# Altium schematic sheet MohamedAazir_WirelessEMG__version_1.0_PCB__Power.schdoc
size 280 x 206 mm
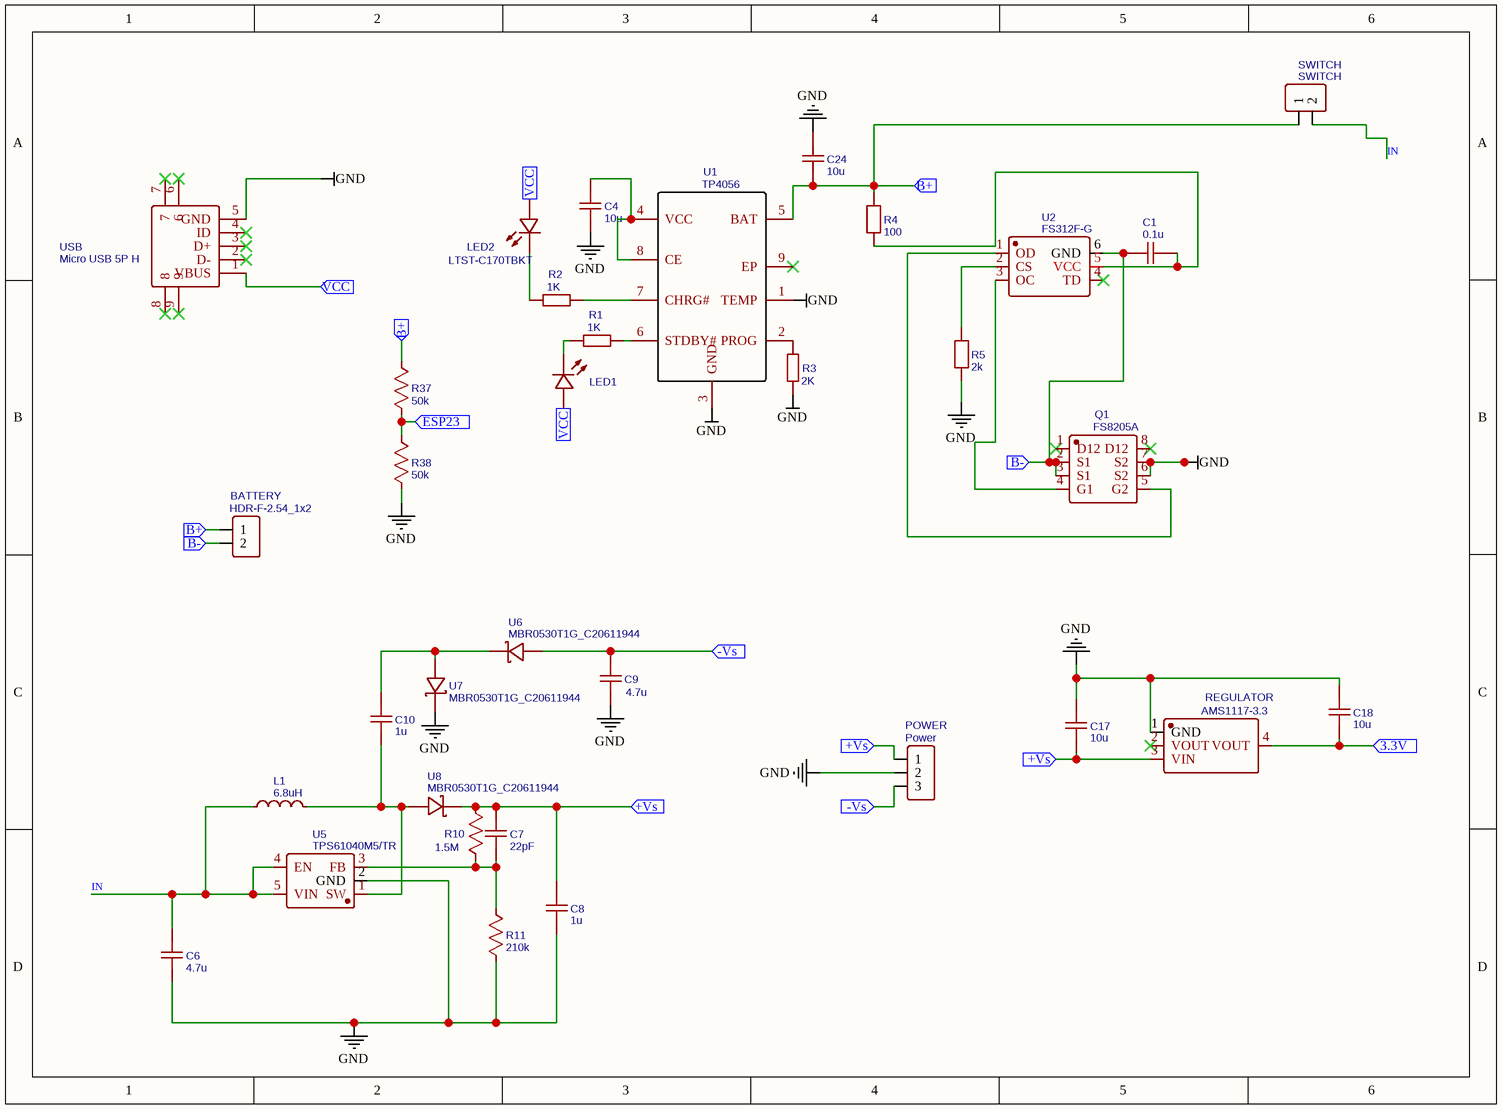
[diagram p0: MohamedAazir_WirelessEMG__version_1.0_PCB__Power.schdoc]

## Parts
BATTERY  HDR-F-2.54_1x2  [HDR-F-2.54_1X2]
C1  0.1u  [C0603]
C4  10u  [C0603]
C6  4.7u  [C0603]
C7  22pF  [C0603]
C8  1u  [C0603]
C9  4.7u  [C0603]
C10  1u  [C0603]
C17  10u  [C0603]
C18  10u  [C0603]
C24  10u  [C0603]
L1  6.8uH  [L0603]
LED1  0805G (Green)  [LED0805-RD_GREEN]  (value not drawn)
LED2  LTST-C170TBKT  [LED0805-RD_BLUE]
POWER  Power  [HDR-TH_3P-P2.54-V-F]
Q1  FS8205A  [TSSOP-8_L4.4-W3.0-P0.65-LS6.4-BL-2]
R1  1K  [R0603]
R2  1K  [R0603]
R3  2K  [R0603]
R4  100  [R0603]
R5  2k  [R0603]
R10  1.5M  [R0603]
R11  210k  [R0603]
R37  50k  [R0603]
R38  50k  [R0603]
REGULATOR  AMS1117-3.3  [SOT-223-3_L6.5-W3.4-P2.30-LS7.0-BR]
SWITCH  SWITCH  [HDR-F-2.54_1X2]
U1  TP4056  [ESOP-8_L4.9-W3.9-P1.27-LS6.0-BL-EP]
U2  FS312F-G  [SOT-23-6_L2.9-W1.6-P0.95-LS2.8-BR]
U5  TPS61040M5/TR  [SOT-23-5_L2.9-W1.6-P0.95-LS2.8-BL]
U6  MBR0530T1G_C20611944  [SOD-123_L2.8-W1.8-LS3.7-RD]
U7  MBR0530T1G_C20611944  [SOD-123_L2.8-W1.8-LS3.7-RD]
U8  MBR0530T1G_C20611944  [SOD-123_L2.8-W1.8-LS3.7-RD]
USB  Micro USB 5P H  [MICRO-USB_MICRO-USB-30]

## Ports
3.3V (in), +Vs (in), -Vs (in), B+ (in), B- (in), ESP23 (in), VCC (in)

## Nets
GND: C4.2 C6.1 C8.1 C9.1 C17.2 C18.2 C24.2 POWER.2 Q1.6(S2) Q1.7(S2) R3.1 R5.1 R11.1 R38.1 REGULATOR.1(GND) U1.1(TEMP) U1.3(GND) U5.2(GND) U7.1(K) USB.5(GND)
3.3V: C18.1 REGULATOR.4(VOUT) ; port 3.3V
+Vs: C7.2 C8.2 C17.1 POWER.1 R10.2 REGULATOR.3(VIN) U8.1(K) ; port +Vs
-Vs: C9.2 POWER.3 U6.2(A) ; port -Vs
B+: BATTERY.1 C24.1 R4.1 R37.2 SWITCH.1 U1.5(BAT) ; port B+
B-: BATTERY.2 C1.1 Q1.2(S1) Q1.3(S1) U2.6(GND) ; port B-
ESP23: R37.1 R38.2 ; port ESP23
IN: C6.2 L1.1 SWITCH.2 U5.4(EN) U5.5(VIN)
VCC: LED1.2(A) LED2.2(A) USB.1(VBUS) ; port VCC
NetC1_2: C1.2 R4.2 U2.5(VCC)
NetC4_1: C4.1 U1.4(VCC) U1.8(CE)
NetC7_1: C7.1 R10.1 R11.2 U5.3(FB)
NetC10_1: C10.1 L1.2 U5.1(SW) U8.2(A)
NetC10_2: C10.2 U6.1(K) U7.2(A)
NetLED1_1: LED1.1(K) R1.1
NetLED2_1: LED2.1(K) R2.1
NetQ1_4: Q1.4(G1) U2.3(OC)
NetQ1_5: Q1.5(G2) U2.1(OD)
NetR1_2: R1.2 U1.6(STDBY#)
NetR2_2: R2.2 U1.7(CHRG#)
NetR3_2: R3.2 U1.2(PROG)
NetR5_2: R5.2 U2.2(CS)

Not connected (* = marked no-connect by the designer): Q1 1(D12)* 8(D12)*; REGULATOR 2(VOUT)*; U1 9(EP)*; U2 4(TD)*; USB 2(D-)* 3(D+)* 4(ID)* 6* 7* 8* 9*

## Library data of the parts
BATTERY = HDR-F-2.54_1x2: Manufacturer: HC(虹成电子); Manufacturer Part: HC-PM254-8.5H-1x2PZ; Contributor: LCEDA_Lib; Supplier Part: C22373888; Supplier: LCSC; spicePre: H; spiceSymbolName: HDR-F-2.54_1x2
C1 = 0.1u: Manufacturer Part: RF18N0R1B500CT; Manufacturer: Walsin(华新科); nameAlias: Value(F); Contributor: LCEDA_Lib; Supplier Part: C304680; Supplier: LCSC; spicePre: C; spiceSymbolName: C_0603_US
C4 = 10u: Manufacturer Part: CA45A-P-10V-10uF-K; Manufacturer: CEC(振华新云); nameAlias: Value(F); Contributor: LCEDA_Lib; Supplier Part: C129234; Supplier: LCSC; spicePre: C; spiceSymbolName: C_0603_US
C6 C9 = 4.7u: Manufacturer Part: CA45B-A-25V-4.7UF-K; Manufacturer: CEC(振华新云); nameAlias: Value(F); Contributor: LCEDA_Lib; Supplier Part: C2976925; Supplier: LCSC; spicePre: C; spiceSymbolName: C_0603_US
C7 = 22pF: Manufacturer Part: 0805N220J500CT-C; Manufacturer: Walsin(华新科); nameAlias: Value(F); Contributor: LCEDA_Lib; Supplier Part: C2991347; Supplier: LCSC; spicePre: C; spiceSymbolName: C_0603_US
C8 C10 = 1u: Manufacturer Part: T491B105M035AT; Manufacturer: KEMET(基美); nameAlias: Value(F); Contributor: LCEDA_Lib; Supplier Part: C600504; Supplier: LCSC; spicePre: C; spiceSymbolName: C_0603_US
C17 C18 = 10u: Manufacturer Part: CGA3E1X7T0G106MT0YHN; Manufacturer: TDK; nameAlias: Value(F); Contributor: LCEDA_Lib; Supplier Part: C5139584; Supplier: LCSC; spicePre: C; spiceSymbolName: C_0603_US
C24 = 10u: nameAlias: Value(F); Contributor: LCEDA_Lib; spicePre: C; spiceSymbolName: C_0603_US
L1 = 6.8uH: Manufacturer Part: BWVF00303015220M00; Manufacturer: chilisin(奇力新); nameAlias: Value(H); Contributor: LCEDA_Lib; Supplier Part: C2847099; Supplier: LCSC; spicePre: L; spiceSymbolName: L0603_US
LED1 = 0805G (Green): Manufacturer: KENTO; Supplier: LCSC; Manufacturer Part: 0805G (Green); Supplier Part: C2297; JLCPCB Part Class: Basic Part; spicePre: L; spiceSymbolName: 0805G (Green)
LED2 = LTST-C170TBKT: Manufacturer: null; Manufacturer Part: LED05-红灯; Contributor: LCSC; Supplier: LCSC; Supplier Part: C9900009041; spicePre: L; spiceSymbolName: LTST-C170TBKT
POWER = Power: Manufacturer: BOOMELE(博穆精密); Manufacturer Part: 2.54-1*3P母; Supplier Part: C146243; Supplier: LCSC; JLCPCB Part Class: Extended Part; spicePre: P; spiceSymbolName: Header-Female-2.54_1x3
Q1 = FS8205A: Manufacturer: FORTUNE; Supplier: LCSC; Manufacturer Part: FS8205A; Supplier Part: C16052; JLCPCB Part Class: Basic Part; spicePre: Q; spiceSymbolName: FS8205A
R1 R2 = 1K: Manufacturer: ResistorToday; Manufacturer Part: AECR0603F1K00K9; nameAlias: Resistance (Ohms); Contributor: LCSC; Supplier: LCSC; Supplier Part: C328340; JLCPCB Part Class: Extended Part; spicePre: R; spiceSymbolName: AECR0603F1K00K9
R3 = 2K: Manufacturer: Tyohm; Manufacturer Part: RMC06031.2K5%N; nameAlias: Resistance (Ohms); Contributor: LCSC; Supplier: LCSC; Supplier Part: C269681; JLCPCB Part Class: Extended Part; spicePre: R; spiceSymbolName: RMC06031.2K5%N
R4 = 100: Manufacturer Part: RC0R5DB100RJET; Manufacturer: Ohmite; nameAlias: Value(Ω); Contributor: LCEDA_Lib; Supplier Part: C4353674; Supplier: LCSC; spicePre: R; spiceSymbolName: R_0603_EU
R5 = 2k: Manufacturer Part: CSR0204FTDV2001; Manufacturer: Viking(光颉); nameAlias: Value(Ω); Contributor: LCEDA_Lib; Supplier Part: C489410; Supplier: LCSC; spicePre: R; spiceSymbolName: R_0603_EU
R10 = 1.5M: Manufacturer Part: WR02X155JAL; Manufacturer: Walsin(华新科); nameAlias: Value(Ω); Contributor: LCEDA_Lib; Supplier Part: C2894201; Supplier: LCSC; spicePre: R; spiceSymbolName: R_0603_US
R11 = 210k: Manufacturer Part: FRC0805F2103TS; Manufacturer: FOJAN(富捷); nameAlias: Value(Ω); Contributor: LCEDA_Lib; Supplier Part: C2933367; Supplier: LCSC; spicePre: R; spiceSymbolName: R_0603_US
R37 R38 = 50k: Manufacturer Part: RT0603BRD0750KL; Manufacturer: YAGEO(国巨); nameAlias: Value(Ω); Contributor: LCEDA_Lib; Supplier Part: C861451; Supplier: LCSC; spicePre: R; spiceSymbolName: R_0603_US
REGULATOR = AMS1117-3.3: Manufacturer: AMS; sourceId: dwIGgezVh; timeStamp: 1476261164; Supplier: LCSC; Manufacturer Part: AMS1117-3.3; Supplier Part: C6186; JLCPCB Part Class: Basic Part; spicePre: U; spiceSymbolName: AMS1117-3.3
SWITCH = SWITCH: Manufacturer: HC(虹成电子); Manufacturer Part: HC-PM254-8.5H-1x2PZ; Contributor: LCEDA_Lib; Supplier Part: C22373888; Supplier: LCSC; spicePre: H; spiceSymbolName: HDR-F-2.54_1x2
U1 = TP4056: Manufacturer: TOPPOWER; Contributor: Guest; Supplier: LCSC; Manufacturer Part: TP4056; Supplier Part: C16581; JLCPCB Part Class: Basic Part; spicePre: U; spiceSymbolName: TP4056
U2 = FS312F-G: Manufacturer: FORTUNE(富晶); Supplier: LCSC; Manufacturer Part: FS312F-G; Supplier Part: C82736; JLCPCB Part Class: Extended Part; spicePre: U; spiceSymbolName: FS312F-G
U5 = TPS61040M5/TR: Manufacturer: HGSEMI(华冠); Contributor: lcsc; Supplier: LCSC; Supplier Part: C2902480; Manufacturer Part: TPS61040M5/TR; JLCPCB Part Class: Extended Part; spicePre: U; spiceSymbolName: TPS61040M5/TR
U6-U8 = MBR0530T1G_C20611944: Manufacturer: HXY MOSFET(华轩阳电子); Contributor: lcsc; Supplier: LCSC; Supplier Part: C20611944; Manufacturer Part: MBR0530T1G; JLCPCB Part Class: Extended Part; spicePre: U; spiceSymbolName: MBR0530T1G_C20611944
USB = Micro USB 5P H: Manufacturer: 精拓金; Manufacturer Part: 920-E52A2021S10101; Contributor: LCSC; Supplier: LCSC; Supplier Part: C40946; JLCPCB Part Class: Extended Part; spicePre: U; spiceSymbolName: Micro USB 5P H